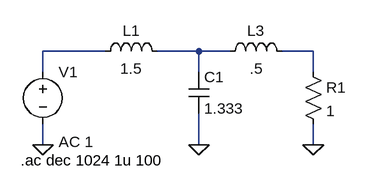
[diagram p0: schematic circuitoasc.asc]
circuitoasc.asc, the LTspice schematic file:
Version 4
SHEET 1 880 680
WIRE 128 96 32 96
WIRE 272 96 208 96
WIRE 320 96 272 96
WIRE 448 96 400 96
WIRE 32 128 32 96
WIRE 272 128 272 96
WIRE 448 128 448 96
WIRE 32 240 32 208
WIRE 272 240 272 192
WIRE 448 240 448 208
FLAG 32 240 0
FLAG 272 240 0
FLAG 448 240 0
SYMBOL voltage 32 112 R0
WINDOW 123 24 124 Left 2
WINDOW 39 0 0 Left 0
SYMATTR InstName V1
SYMATTR Value ""
SYMATTR Value2 AC 1
SYMBOL ind 112 112 R270
WINDOW 0 32 56 VTop 2
WINDOW 3 5 56 VBottom 2
SYMATTR InstName L1
SYMATTR Value 1.5
SYMBOL ind 304 112 R270
WINDOW 0 32 56 VTop 2
WINDOW 3 5 56 VBottom 2
SYMATTR InstName L3
SYMATTR Value .5
SYMBOL cap 256 128 R0
SYMATTR InstName C1
SYMATTR Value 1.333
SYMBOL res 432 112 R0
SYMATTR InstName R1
SYMATTR Value 1
TEXT -2 264 Left 2 !.ac dec 1024 1u 100

The netlist it stands for:
* circuitoasc.asc
V1 N001 0 AC 1
L1 N001 N002 1.5
L3 N002 N003 .5
C1 N002 0 1.333
R1 N003 0 1
.ac dec 1024 1u 100
.backanno
.end